# EAGLE schematic daughterboard_2sheetbackup (EAGLE 9.6.2)

## Sheet 1 of 2
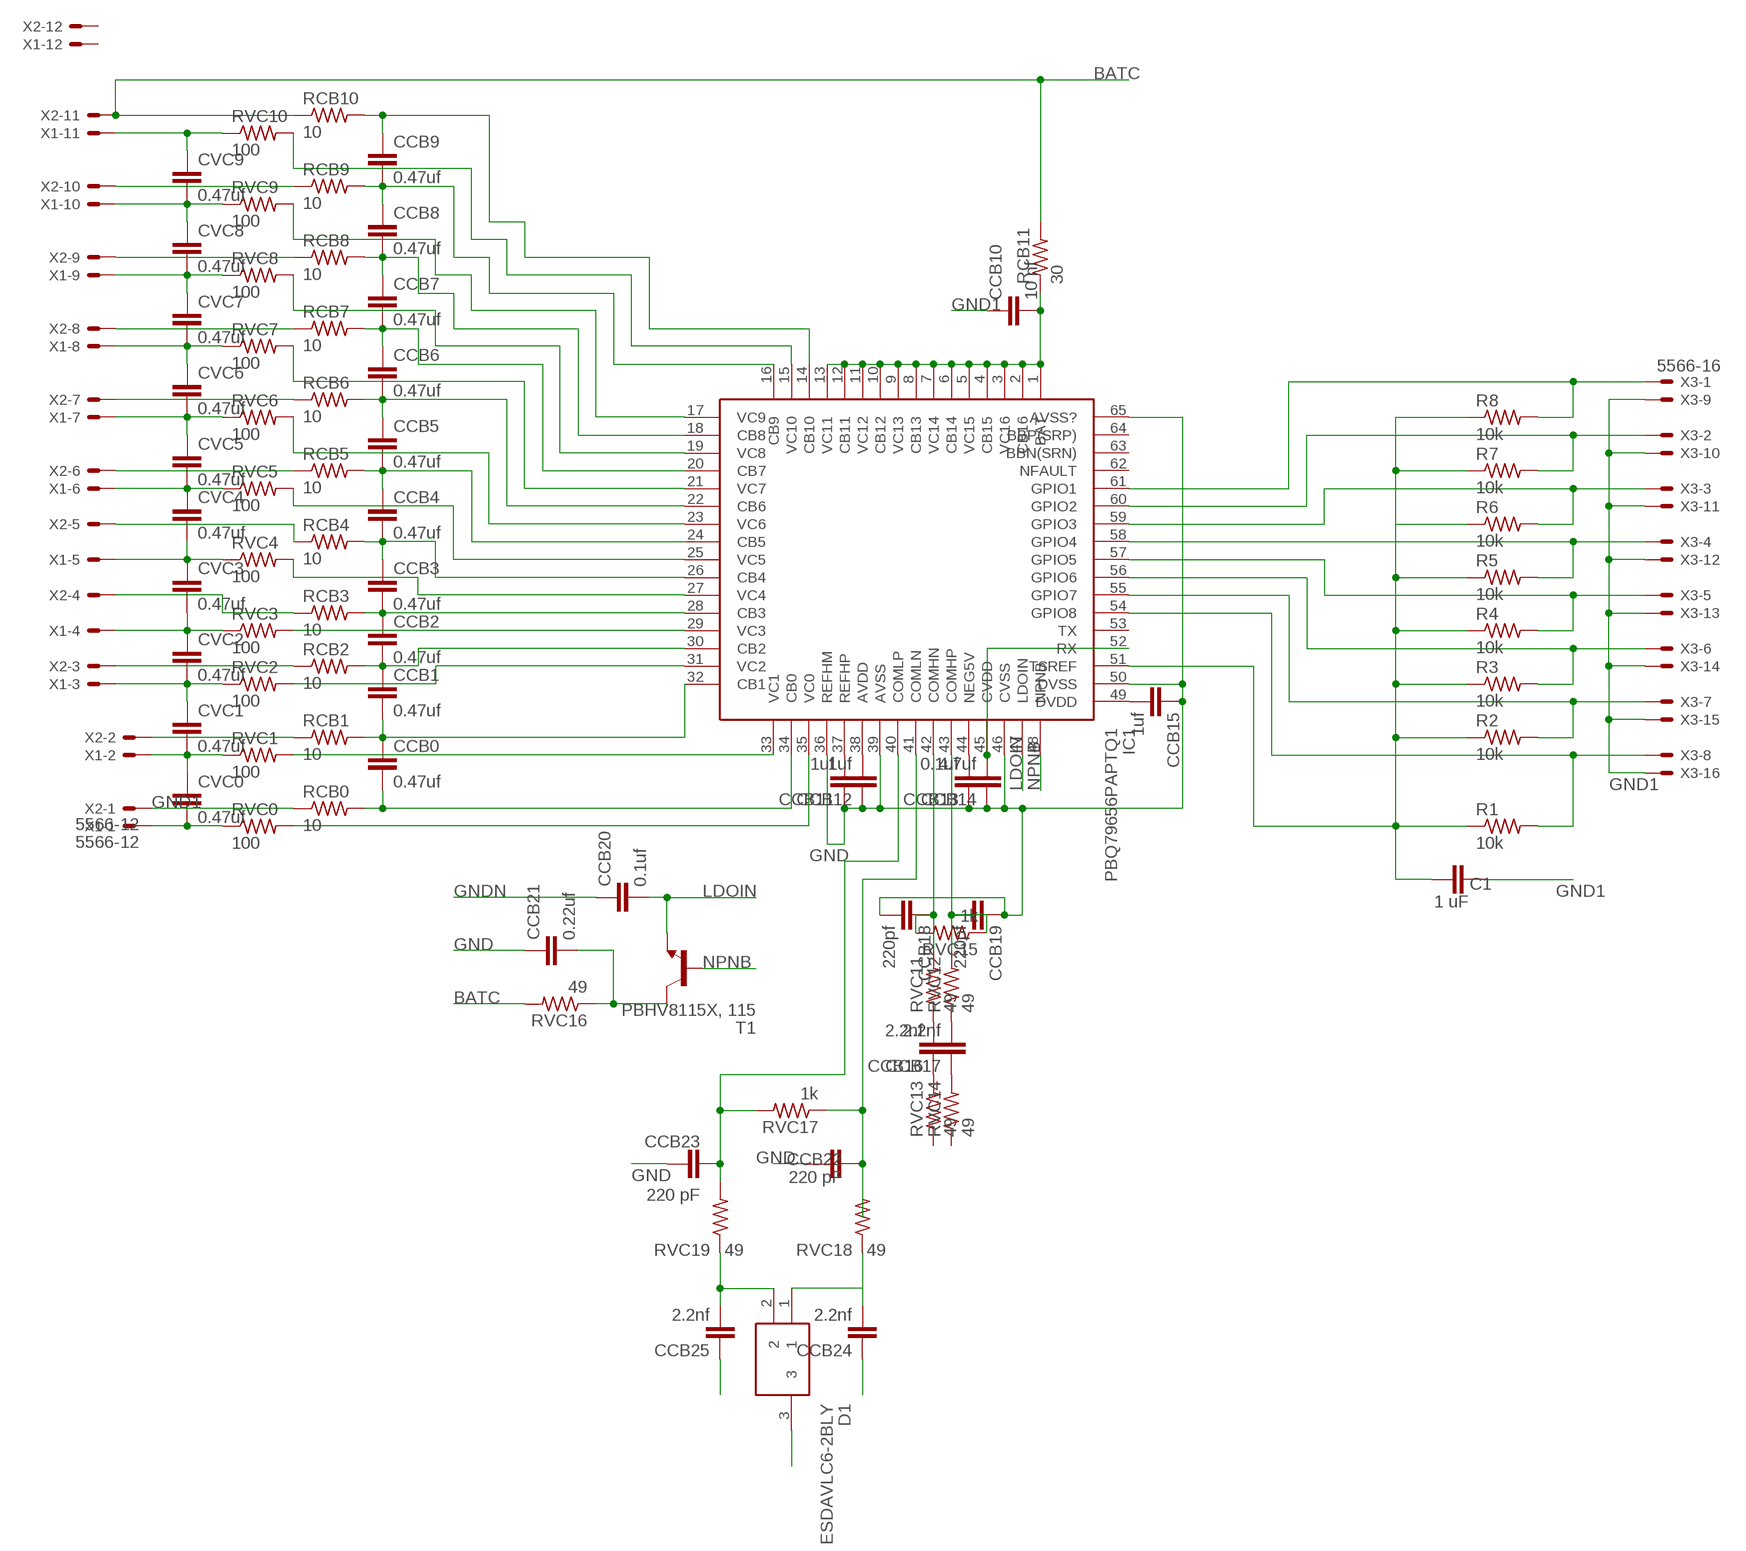
[diagram p0: schematic, sheet 1]

### Parts
C1  1 uF  C2.5/2  [C2.5-2]
CCB0  0.47uf  C2.5/2  [C2.5-2]
CCB1  0.47uf  C2.5/2  [C2.5-2]
CCB2  0.47uf  C2.5/2  [C2.5-2]
CCB3  0.47uf  C2.5/2  [C2.5-2]
CCB4  0.47uf  C2.5/2  [C2.5-2]
CCB5  0.47uf  C2.5/2  [C2.5-2]
CCB6  0.47uf  C2.5/2  [C2.5-2]
CCB7  0.47uf  C2.5/2  [C2.5-2]
CCB8  0.47uf  C2.5/2  [C2.5-2]
CCB9  0.47uf  C2.5/2  [C2.5-2]
CCB10  10 nf  C2.5/2  [C2.5-2]
CCB11  1uf  C2.5/2  [C2.5-2]
CCB12  1uf  C2.5/2  [C2.5-2]
CCB13  0.1uf  C2.5/2  [C2.5-2]
CCB14  4.7uf  C2.5/2  [C2.5-2]
CCB15  1uf  C2.5/2  [C2.5-2]
CCB16  2.2nf  C2.5/2  [C2.5-2]
CCB17  2.2nf  C2.5/2  [C2.5-2]
CCB18  220pf  C2.5/2  [C2.5-2]
CCB19  220pf  C2.5/2  [C2.5-2]
CCB20  0.1uf  C2.5/2  [C2.5-2]
CCB21  0.22uf  C2.5/2  [C2.5-2]
CCB22  220 pF  C2.5/2  [C2.5-2]
CCB23  220 pF  C2.5/2  [C2.5-2]
CCB24  2.2nf  C2.5/2  [C2.5-2]
CCB25  2.2nf  C2.5/2  [C2.5-2]
CVC0  0.47uf  C2.5/2  [C2.5-2]
CVC1  0.47uf  C2.5/2  [C2.5-2]
CVC2  0.47uf  C2.5/2  [C2.5-2]
CVC3  0.47uf  C2.5/2  [C2.5-2]
CVC4  0.47uf  C2.5/2  [C2.5-2]
CVC5  0.47uf  C2.5/2  [C2.5-2]
CVC6  0.47uf  C2.5/2  [C2.5-2]
CVC7  0.47uf  C2.5/2  [C2.5-2]
CVC8  0.47uf  C2.5/2  [C2.5-2]
CVC9  0.47uf  C2.5/2  [C2.5-2]
D1  ESDAVLC6-2BLY  [SOT95P255X150-3N]
IC1  PBQ79656PAPTQ1  [QFP50P1200X1200X120-65N]
R1  10k  R-US_R0603  [R0603]
R2  10k  R-US_R0603  [R0603]
R3  10k  R-US_R0603  [R0603]
R4  10k  R-US_R0603  [R0603]
R5  10k  R-US_R0603  [R0603]
R6  10k  R-US_R0603  [R0603]
R7  10k  R-US_R0603  [R0603]
R8  10k  R-US_R0603  [R0603]
RCB0  10  R-US_R0603  [R0603]
RCB1  10  R-US_R0603  [R0603]
RCB2  10  R-US_R0603  [R0603]
RCB3  10  R-US_R0603  [R0603]
RCB4  10  R-US_R0603  [R0603]
RCB5  10  R-US_R0603  [R0603]
RCB6  10  R-US_R0603  [R0603]
RCB7  10  R-US_R0603  [R0603]
RCB8  10  R-US_R0603  [R0603]
RCB9  10  R-US_R0603  [R0603]
RCB10  10  R-US_R0603  [R0603]
RCB11  30  R-US_R0603  [R0603]
RVC0  100  R-US_R0603  [R0603]
RVC1  100  R-US_R0603  [R0603]
RVC2  100  R-US_R0603  [R0603]
RVC3  100  R-US_R0603  [R0603]
RVC4  100  R-US_R0603  [R0603]
RVC5  100  R-US_R0603  [R0603]
RVC6  100  R-US_R0603  [R0603]
RVC7  100  R-US_R0603  [R0603]
RVC8  100  R-US_R0603  [R0603]
RVC9  100  R-US_R0603  [R0603]
RVC10  100  R-US_R0603  [R0603]
RVC11  49  R-US_R0603  [R0603]
RVC12  49  R-US_R0603  [R0603]
RVC13  49  R-US_R0603  [R0603]
RVC14  49  R-US_R0603  [R0603]
RVC15  1k  R-US_R0603  [R0603]
RVC16  49  R-US_R0603  [R0603]
RVC17  1k  R-US_R0603  [R0603]
RVC18  49  R-US_R0603  [R0603]
RVC19  49  R-US_R0603  [R0603]
T1  PBHV8115X, 115  BC868-NPN-SOT89-BCE  [SOT89-BCE]
X1  5566-12  [5566-12]
X2  5566-12  [5566-12]
X3  5566-16  [5566-16]

### Nets
BATC: RCB10.1 RCB11.2 RVC16.2 X2.11
CVDD: CCB14.2 IC1.45(CVDD) IC1.52(RX)
GND: CCB11.1 CCB12.1 CCB13.1 CCB14.1 CCB15.1 CCB18.2 CCB19.1 CCB21.1 CCB22.1 CCB23.1 D1.3 IC1.36(REFHM) IC1.39(AVSS) IC1.46(CVSS) IC1.50(DVSS) IC1.65(AVSS?)
GND1: C1.1 CCB10.1 RCB0.1 X2.1 X3.9 X3.10 X3.11 X3.12 X3.13 X3.14 X3.15 X3.16
GNDN: CCB20.1
LDOIN: CCB20.2 IC1.47(LDOIN) T1.E
N$1: IC1.33(VC1) RVC1.2
N$2: CCB0.1 CCB1.2 IC1.32(CB1) RCB1.2
N$3: IC1.31(VC2) RVC2.2
N$4: CCB1.1 CCB2.2 IC1.30(CB2) RCB2.2
N$5: RCB1.1 X2.2
N$6: RCB2.1 X2.3
N$7: CCB2.1 CCB3.2 IC1.28(CB3) RCB3.2
N$8: RCB3.1 X2.4
N$9: IC1.29(VC3) RVC3.2
N$10: IC1.27(VC4) RVC4.2
N$11: CCB6.1 CCB7.2 IC1.20(CB7) RCB7.2
N$12: RCB4.1 X2.5
N$13: CCB3.1 CCB4.2 IC1.26(CB4) RCB4.2
N$14: IC1.25(VC5) RVC5.2
N$15: RCB5.1 X2.6
N$16: CCB4.1 CCB5.2 IC1.24(CB5) RCB5.2
N$17: IC1.19(VC8) RVC8.2
N$18: RCB8.1 X2.9
N$19: CCB7.1 CCB8.2 IC1.18(CB8) RCB8.2
N$20: IC1.17(VC9) RVC9.2
N$21: RCB9.1 X2.10
N$22: CCB8.1 CCB9.2 IC1.16(CB9) RCB9.2
N$23: IC1.15(VC10) RVC10.2
N$24: IC1.35(VC0) RVC0.2
N$25: CCB0.2 IC1.34(CB0) RCB0.2
N$26: IC1.23(VC6) RVC6.2
N$27: RCB6.1 X2.7
N$28: CCB5.1 CCB6.2 IC1.22(CB6) RCB6.2
N$29: CCB22.2 IC1.41(COMLN) RVC17.1 RVC18.2
N$30: IC1.21(VC7) RVC7.2
N$31: RCB7.1 X2.8
N$32: CCB9.1 IC1.14(CB10) RCB10.2
N$33: CCB11.2 IC1.37(REFHP)
N$34: CVC0.2 RVC0.1 X1.1
N$35: CVC0.1 CVC1.2 RVC1.1 X1.2
N$36: CVC1.1 CVC2.2 RVC2.1 X1.3
N$37: CVC2.1 CVC3.2 RVC3.1 X1.4
N$38: CVC3.1 CVC4.2 RVC4.1 X1.5
N$39: CVC4.1 CVC5.2 RVC5.1 X1.6
N$40: CVC5.1 CVC6.2 RVC6.1 X1.7
N$41: CVC6.1 CVC7.2 RVC7.1 X1.8
N$42: CVC7.1 CVC8.2 RVC8.1 X1.9
N$43: CVC8.1 CVC9.2 RVC9.1 X1.10
N$44: CVC9.1 RVC10.1 X1.11
N$45: CCB10.2 IC1.1(BAT) IC1.2(CB16) IC1.3(VC16) IC1.4(CB15) IC1.5(VC15) IC1.6(CB14) IC1.7(VC14) IC1.8(CB13) IC1.9(VC13) IC1.10(CB12) IC1.11(VC12) IC1.12(CB11) IC1.13(VC11) RCB11.1
N$46: CCB12.2 IC1.38(AVDD)
N$47: IC1.61(GPIO1) R8.2 X3.1
N$48: CCB13.2 IC1.44(NEG5V)
N$49: CCB23.2 IC1.40(COMLP) RVC17.2 RVC19.2
N$50: CCB15.2 IC1.49(DVDD)
N$51: IC1.60(GPIO2) R7.2 X3.2
N$52: IC1.59(GPIO3) R6.2 X3.3
N$53: IC1.58(GPIO4) R5.2 X3.4
N$54: IC1.57(GPIO5) R4.2 X3.5
N$55: IC1.56(GPIO6) R3.2 X3.6
N$56: IC1.55(GPIO7) R2.2 X3.7
N$57: IC1.54(GPIO8) R1.2 X3.8
N$58: C1.2 IC1.51(TSREF) R1.1 R2.1 R3.1 R4.1 R5.1 R6.1 R7.1 R8.1
N$59: CCB18.1 IC1.42(COMHN) RVC11.2 RVC15.2
N$60: CCB19.2 IC1.43(COMHP) RVC12.2 RVC15.1
N$61: CCB16.2 RVC11.1
N$62: CCB17.2 RVC12.1
N$63: CCB16.1 RVC13.2
N$64: CCB17.1 RVC14.2
N$65: CCB21.2 RVC16.1 T1.C
N$66: CCB25.1
N$67: CCB25.2 D1.2 RVC19.1
N$68: CCB24.2 D1.1 RVC18.1
N$69: CCB24.1
NPNB: IC1.48(NPNB) T1.B
Unconnected: IC1.53(TX) IC1.62(NFAULT) IC1.63(BBN(SRN)) IC1.64(BBP(SRP)) RVC13.1 RVC14.1 X1.12 X2.12

## Sheet 2 of 2
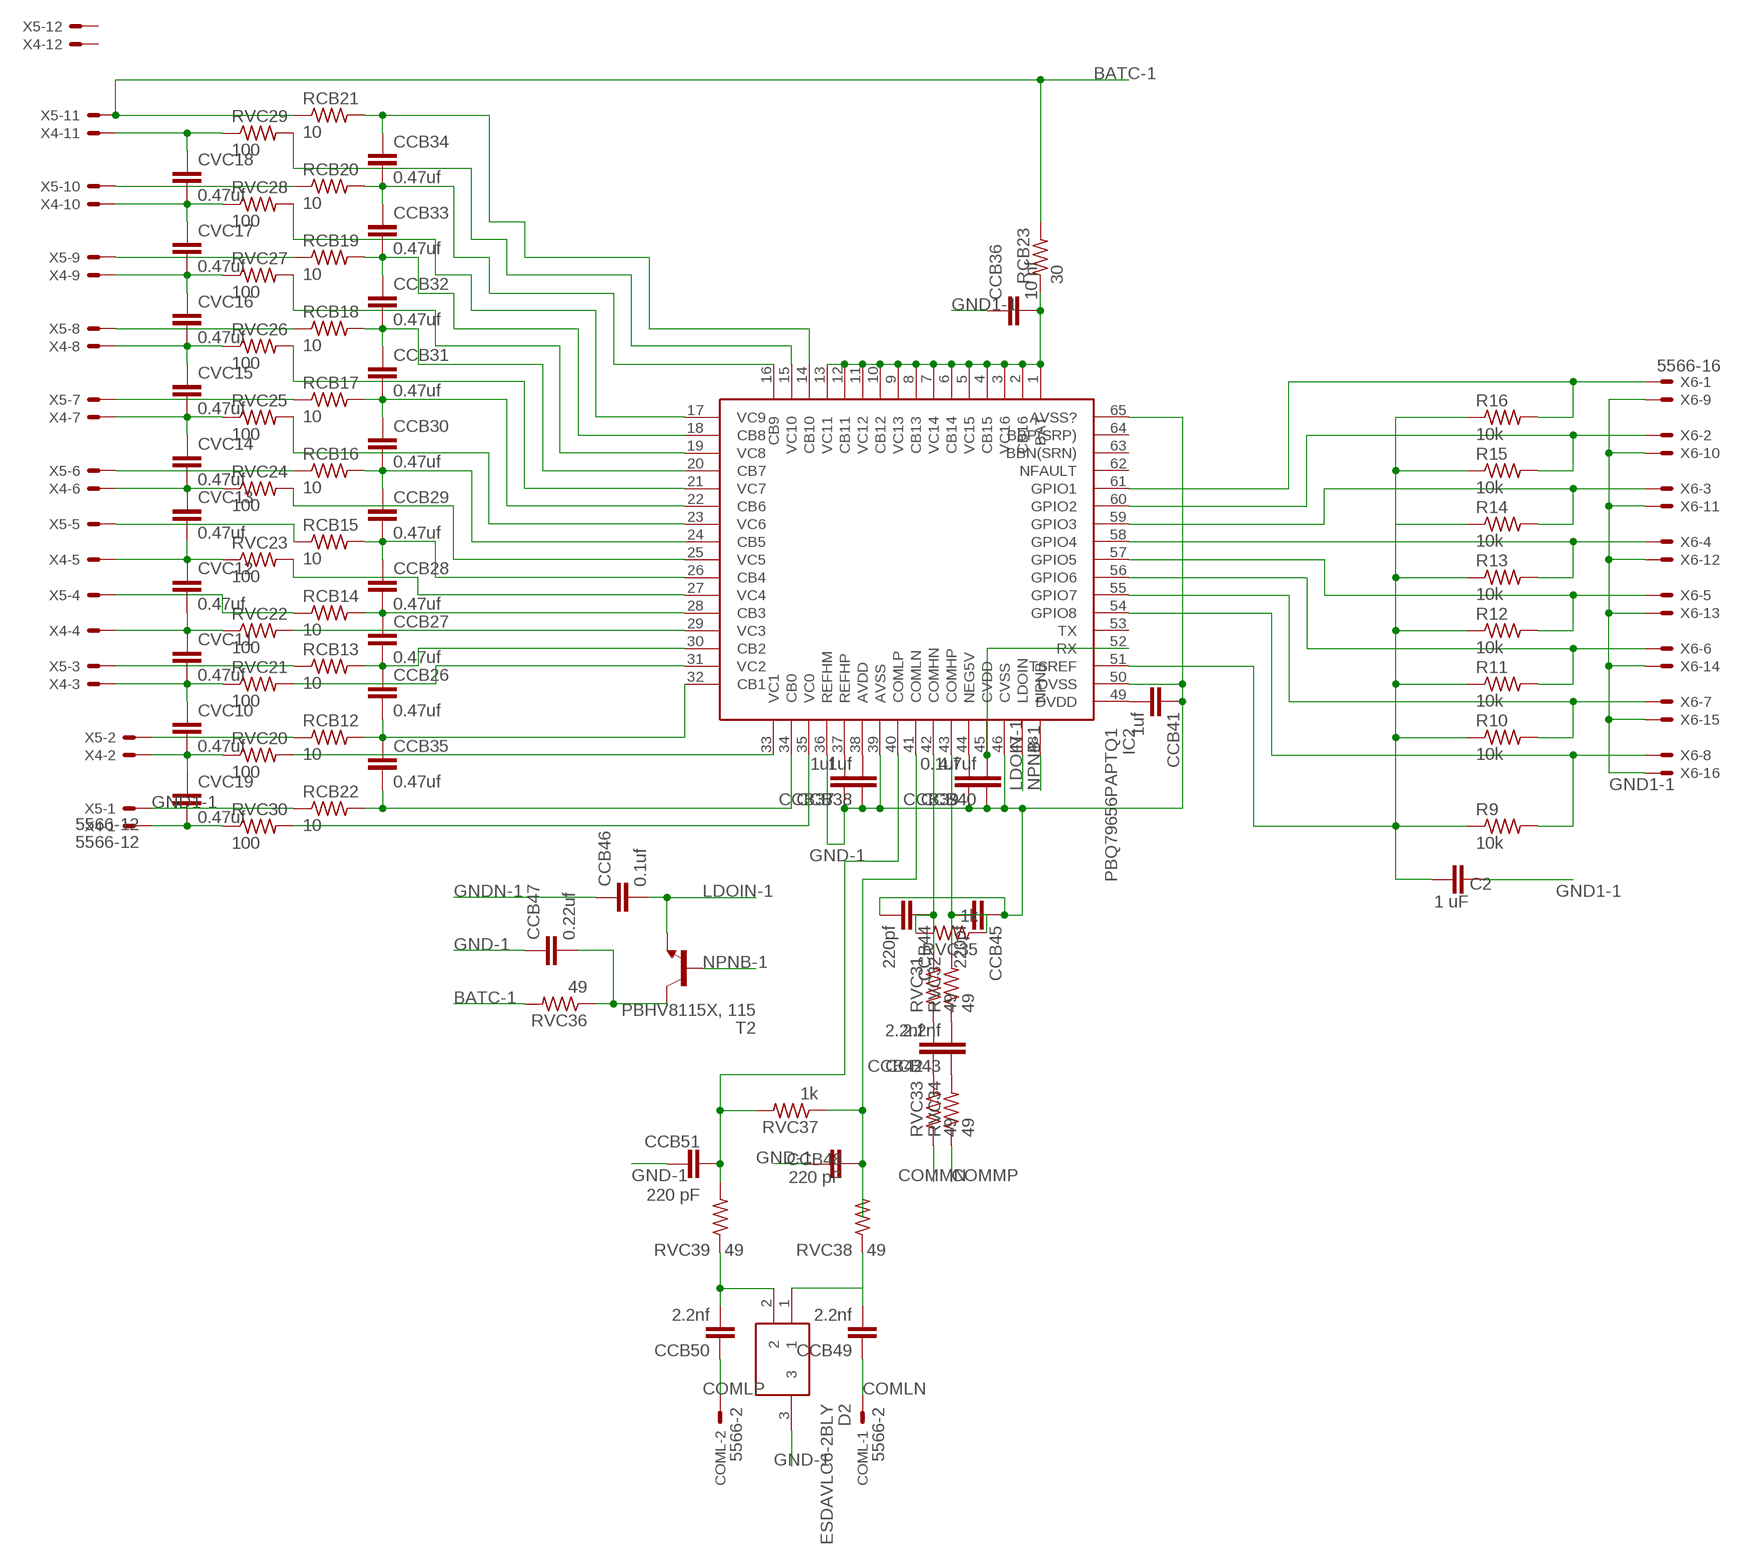
[diagram p1: schematic, sheet 2]

### Parts
C2  1 uF  C-EUC0603  [C0603]
CCB26  0.47uf  C-EUC0603  [C0603]
CCB27  0.47uf  C-EUC0603  [C0603]
CCB28  0.47uf  C-EUC0603  [C0603]
CCB29  0.47uf  C-EUC0603  [C0603]
CCB30  0.47uf  C-EUC0603  [C0603]
CCB31  0.47uf  C-EUC0603  [C0603]
CCB32  0.47uf  C-EUC0603  [C0603]
CCB33  0.47uf  C-EUC0603  [C0603]
CCB34  0.47uf  C-EUC0603  [C0603]
CCB35  0.47uf  C-EUC0603  [C0603]
CCB36  10 nf  C-EUC0603  [C0603]
CCB37  1uf  C-EUC0603  [C0603]
CCB38  1uf  C-EUC0603  [C0603]
CCB39  0.1uf  C-EUC0603  [C0603]
CCB40  4.7uf  C-EUC0603  [C0603]
CCB41  1uf  C-EUC0603  [C0603]
CCB42  2.2nf  C-EUC0603  [C0603]
CCB43  2.2nf  C-EUC0603  [C0603]
CCB44  220pf  C-EUC0603  [C0603]
CCB45  220pf  C-EUC0603  [C0603]
CCB46  0.1uf  C-EUC0603  [C0603]
CCB47  0.22uf  C-EUC0603  [C0603]
CCB48  220 pF  C-EUC0603  [C0603]
CCB49  2.2nf  C-EUC0603  [C0603]
CCB50  2.2nf  C-EUC0603  [C0603]
CCB51  220 pF  C-EUC0603  [C0603]
COML  5566-2  [5566-2]
CVC10  0.47uf  C-EUC0603  [C0603]
CVC11  0.47uf  C-EUC0603  [C0603]
CVC12  0.47uf  C-EUC0603  [C0603]
CVC13  0.47uf  C-EUC0603  [C0603]
CVC14  0.47uf  C-EUC0603  [C0603]
CVC15  0.47uf  C-EUC0603  [C0603]
CVC16  0.47uf  C-EUC0603  [C0603]
CVC17  0.47uf  C-EUC0603  [C0603]
CVC18  0.47uf  C-EUC0603  [C0603]
CVC19  0.47uf  C-EUC0603  [C0603]
D2  ESDAVLC6-2BLY  [SOT95P255X150-3N]
IC2  PBQ79656PAPTQ1  [QFP50P1200X1200X120-65N]
R9  10k  R-US_R0603  [R0603]
R10  10k  R-US_R0603  [R0603]
R11  10k  R-US_R0603  [R0603]
R12  10k  R-US_R0603  [R0603]
R13  10k  R-US_R0603  [R0603]
R14  10k  R-US_R0603  [R0603]
R15  10k  R-US_R0603  [R0603]
R16  10k  R-US_R0603  [R0603]
RCB12  10  R-US_R0603  [R0603]
RCB13  10  R-US_R0603  [R0603]
RCB14  10  R-US_R0603  [R0603]
RCB15  10  R-US_R0603  [R0603]
RCB16  10  R-US_R0603  [R0603]
RCB17  10  R-US_R0603  [R0603]
RCB18  10  R-US_R0603  [R0603]
RCB19  10  R-US_R0603  [R0603]
RCB20  10  R-US_R0603  [R0603]
RCB21  10  R-US_R0603  [R0603]
RCB22  10  R-US_R0603  [R0603]
RCB23  30  R-US_R0603  [R0603]
RVC20  100  R-US_R0603  [R0603]
RVC21  100  R-US_R0603  [R0603]
RVC22  100  R-US_R0603  [R0603]
RVC23  100  R-US_R0603  [R0603]
RVC24  100  R-US_R0603  [R0603]
RVC25  100  R-US_R0603  [R0603]
RVC26  100  R-US_R0603  [R0603]
RVC27  100  R-US_R0603  [R0603]
RVC28  100  R-US_R0603  [R0603]
RVC29  100  R-US_R0603  [R0603]
RVC30  100  R-US_R0603  [R0603]
RVC31  49  R-US_R0603  [R0603]
RVC32  49  R-US_R0603  [R0603]
RVC33  49  R-US_R0603  [R0603]
RVC34  49  R-US_R0603  [R0603]
RVC35  1k  R-US_R0603  [R0603]
RVC36  49  R-US_R0603  [R0603]
RVC37  1k  R-US_R0603  [R0603]
RVC38  49  R-US_R0603  [R0603]
RVC39  49  R-US_R0603  [R0603]
T2  PBHV8115X, 115  BC868-NPN-SOT89-BCE  [SOT89-BCE]
X4  5566-12  [5566-12]
X5  5566-12  [5566-12]
X6  5566-16  [5566-16]

### Nets
BATC-1: RCB21.1 RCB23.2 RVC36.2 X5.11
COMLN: CCB49.1 COML.1
COMLP: CCB50.1 COML.2
COMMN: RVC33.1
COMMP: RVC34.1
CVDD-1: CCB40.2 IC2.45(CVDD) IC2.52(RX)
GND1-1: C2.1 CCB36.1 RCB22.1 X5.1 X6.9 X6.10 X6.11 X6.12 X6.13 X6.14 X6.15 X6.16
GND-1: CCB37.1 CCB38.1 CCB39.1 CCB40.1 CCB41.1 CCB44.2 CCB45.1 CCB47.1 CCB48.1 CCB51.1 D2.3 IC2.36(REFHM) IC2.39(AVSS) IC2.46(CVSS) IC2.50(DVSS) IC2.65(AVSS?)
GNDN-1: CCB46.1
LDOIN-1: CCB46.2 IC2.47(LDOIN) T2.E
N$70: IC2.33(VC1) RVC20.2
N$71: CCB26.2 CCB35.1 IC2.32(CB1) RCB12.2
N$72: IC2.31(VC2) RVC21.2
N$73: CCB26.1 CCB27.2 IC2.30(CB2) RCB13.2
N$74: RCB13.1 X5.3
N$75: RCB12.1 X5.2
N$76: CCB27.1 CCB28.2 IC2.28(CB3) RCB14.2
N$77: RCB14.1 X5.4
N$78: IC2.29(VC3) RVC22.2
N$79: IC2.27(VC4) RVC23.2
N$80: RCB15.1 X5.5
N$81: CCB28.1 CCB29.2 IC2.26(CB4) RCB15.2
N$82: IC2.25(VC5) RVC24.2
N$83: RCB16.1 X5.6
N$84: CCB29.1 CCB30.2 IC2.24(CB5) RCB16.2
N$85: IC2.23(VC6) RVC25.2
N$86: RCB17.1 X5.7
N$87: CCB30.1 CCB31.2 IC2.22(CB6) RCB17.2
N$88: IC2.21(VC7) RVC26.2
N$89: RCB18.1 X5.8
N$90: CCB31.1 CCB32.2 IC2.20(CB7) RCB18.2
N$91: IC2.19(VC8) RVC27.2
N$92: RCB19.1 X5.9
N$93: CCB32.1 CCB33.2 IC2.18(CB8) RCB19.2
N$94: IC2.17(VC9) RVC28.2
N$95: RCB20.1 X5.10
N$96: CCB33.1 CCB34.2 IC2.16(CB9) RCB20.2
N$97: IC2.15(VC10) RVC29.2
N$98: CCB34.1 IC2.14(CB10) RCB21.2
N$99: IC2.35(VC0) RVC30.2
N$100: CCB35.2 IC2.34(CB0) RCB22.2
N$101: CVC19.2 RVC30.1 X4.1
N$102: CVC10.2 CVC19.1 RVC20.1 X4.2
N$103: CVC10.1 CVC11.2 RVC21.1 X4.3
N$104: CVC11.1 CVC12.2 RVC22.1 X4.4
N$105: CVC12.1 CVC13.2 RVC23.1 X4.5
N$106: CVC13.1 CVC14.2 RVC24.1 X4.6
N$107: CVC14.1 CVC15.2 RVC25.1 X4.7
N$108: CVC15.1 CVC16.2 RVC26.1 X4.8
N$109: CVC16.1 CVC17.2 RVC27.1 X4.9
N$110: CVC17.1 CVC18.2 RVC28.1 X4.10
N$111: CVC18.1 RVC29.1 X4.11
N$112: CCB36.2 IC2.1(BAT) IC2.2(CB16) IC2.3(VC16) IC2.4(CB15) IC2.5(VC15) IC2.6(CB14) IC2.7(VC14) IC2.8(CB13) IC2.9(VC13) IC2.10(CB12) IC2.11(VC12) IC2.12(CB11) IC2.13(VC11) RCB23.1
N$113: CCB37.2 IC2.37(REFHP)
N$114: CCB38.2 IC2.38(AVDD)
N$115: CCB39.2 IC2.44(NEG5V)
N$116: CCB41.2 IC2.49(DVDD)
N$117: IC2.61(GPIO1) R16.2 X6.1
N$118: IC2.60(GPIO2) R15.2 X6.2
N$119: IC2.59(GPIO3) R14.2 X6.3
N$120: IC2.58(GPIO4) R13.2 X6.4
N$121: IC2.57(GPIO5) R12.2 X6.5
N$122: IC2.56(GPIO6) R11.2 X6.6
N$123: IC2.55(GPIO7) R10.2 X6.7
N$124: IC2.54(GPIO8) R9.2 X6.8
N$125: C2.2 IC2.51(TSREF) R9.1 R10.1 R11.1 R12.1 R13.1 R14.1 R15.1 R16.1
N$126: CCB44.1 IC2.42(COMHN) RVC31.2 RVC35.2
N$127: CCB45.2 IC2.43(COMHP) RVC32.2 RVC35.1
N$128: CCB42.2 RVC31.1
N$129: CCB43.2 RVC32.1
N$130: CCB42.1 RVC33.2
N$131: CCB43.1 RVC34.2
N$132: CCB47.2 RVC36.1 T2.C
N$133: CCB48.2 IC2.41(COMLN) RVC37.1 RVC38.2
N$134: CCB51.2 IC2.40(COMLP) RVC37.2 RVC39.2
N$135: CCB50.2 D2.2 RVC39.1
N$136: CCB49.2 D2.1 RVC38.1
NPNB-1: IC2.48(NPNB) T2.B
Unconnected: IC2.53(TX) IC2.62(NFAULT) IC2.63(BBN(SRN)) IC2.64(BBP(SRP)) X4.12 X5.12

## Library data of the parts
C1 CCB0 CCB1-CCB25 CVC0 CVC1-CVC9 = capacitor-wima:C: CAPACITOR naming: grid - package width
C2 CCB26-CCB51 CVC10-CVC19 = rcl:C-EU: CAPACITOR, European symbol; SPICEPREFIX: C
COML = con-molex:5566-2: Mini FIT connector 2 pol Source: http://www.molex.com; MF: MOLEX; OC_FARNELL: 1822072; OC_NEWARK: unknown
D1 D2 = ESDAVLC6-2BLY:ESDAVLC6-2BLY: STMICROELECTRONICS - ESDAVLC6-2BLY - ESD Protection Device, 17 V, SOT-23, 3 Pins, 5 V, 140 W, ESDA Transil Series Source: Datasheet <http://www.st.com/resource/en/datasheet/esdavlc6-2bly.pdf>; DESCRIPTION: STMICROELECTRONICS - ESDAVLC6-2BLY - ESD Protection Device, 17 V, SOT-23, 3 Pins, 5 V, 140 W, ESDA Transil Series; HEIGHT: 1.5mm; MANUFACTURER_NAME: STMicroelectronics; MANUFACTURER_PART_NUMBER: ESDAVLC6-2BLY; MOUSER_PART_NUMBER: 511-ESDAVLC6-2BLY; MOUSER_PRICE-STOCK: https://www.mouser.co.uk/ProductDetail/STMicroelectronics/ESDAVLC6-2BLY?qs=l7cgNqFNU1iH2e21evvYsA%3D%3D
IC1 IC2 = PBQ79656PAPTQ1:PBQ79656PAPTQ1: BQ7965x-Q1 Family of 12S, 14S, 16S Precision Automotive Battery Monitor, Balancer and Integrated Hardware Protector with up to SafeTITM-26262 ASIL-D Compliance Source: Datasheet <http://www.ti.com/lit/ds/symlink/bq79616-q1.pdf>; DESCRIPTION: BQ7965x-Q1 Family of 12S, 14S, 16S Precision Automotive Battery Monitor, Balancer and Integrated Hardware Protector with up to SafeTITM-26262 ASIL-D Compliance; HEIGHT: 1.2mm; MANUFACTURER_NAME: Texas Instruments; MANUFACTURER_PART_NUMBER: PBQ79656PAPTQ1
R1-R16 RCB0 RCB1-RCB23 RVC0 RVC1-RVC39 = rcl:R-US_: RESISTOR, American symbol; SPICEPREFIX: R
T1 T2 = transistor:*-NPN-: NPN Transistror BF959 corrected 2008.03.06
X1 X2 X4 X5 = con-molex:5566-12: Mini FIT connector 12 pol Source: http://www.molex.com; MF: MOLEX; OC_FARNELL: unknown; OC_NEWARK: unknown
X3 X6 = con-molex:5566-16: Mini FIT connector 16 pol Source: http://www.molex.com; MF: MOLEX; OC_FARNELL: unknown; OC_NEWARK: unknown